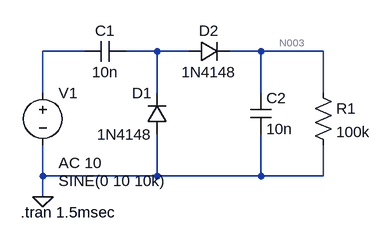
[diagram p0: schematic Aufgabe1.asc]
Aufgabe1.asc, the LTspice schematic file:
Version 4
SHEET 1 880 680
WIRE 192 160 128 160
WIRE 304 160 256 160
WIRE 352 160 304 160
WIRE 464 160 416 160
WIRE 560 160 464 160
WIRE 128 224 128 160
WIRE 304 224 304 160
WIRE 464 224 464 160
WIRE 560 224 560 160
WIRE 128 352 128 304
WIRE 304 352 304 288
WIRE 304 352 128 352
WIRE 464 352 464 288
WIRE 464 352 304 352
WIRE 560 352 560 304
WIRE 560 352 464 352
WIRE 128 384 128 352
FLAG 128 384 0
SYMBOL voltage 128 208 R0
WINDOW 3 24 152 Left 2
WINDOW 123 24 124 Left 2
WINDOW 39 0 0 Left 0
SYMATTR InstName V1
SYMATTR Value SINE(0 10 10k)
SYMATTR Value2 AC 10
SYMBOL cap 256 144 R90
WINDOW 0 0 32 VBottom 2
WINDOW 3 32 32 VTop 2
SYMATTR InstName C1
SYMATTR Value 10n
SYMBOL diode 320 288 R180
WINDOW 0 24 64 Left 2
WINDOW 3 24 0 Left 2
SYMATTR InstName D1
SYMATTR Value 1N4148
SYMBOL diode 352 176 R270
WINDOW 0 32 32 VTop 2
WINDOW 3 0 32 VBottom 2
SYMATTR InstName D2
SYMATTR Value 1N4148
SYMBOL cap 448 224 R0
SYMATTR InstName C2
SYMATTR Value 10n
SYMBOL res 544 208 R0
SYMATTR InstName R1
SYMATTR Value 100k
TEXT 94 408 Left 2 !.tran 1.5msec

The netlist it stands for:
* Aufgabe1.asc
V1 N001 0 SINE(0 10 10k) AC 10
C1 N002 N001 10n
D1 0 N002 1N4148
D2 N002 N003 1N4148
C2 N003 0 10n
R1 N003 0 100k
.model D D
.lib standard.dio
.tran 1.5msec
.backanno
.end

* Results of the author's LTspice run, read from the files saved beside the schematic
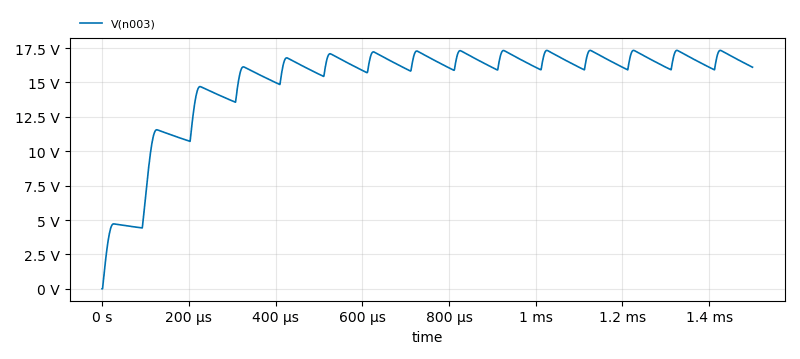
[diagram p1: Transient Analysis of Aufgabe1.asc, plotted from the saved traces]
* Transient Analysis, 1 run:
*   V(n003): min 0 V, max 17.33 V, average 15.09 V, rms 15.45 V, last 16.1 V